# Altium schematic sheet Motor Controller(old).SchDoc
size A4
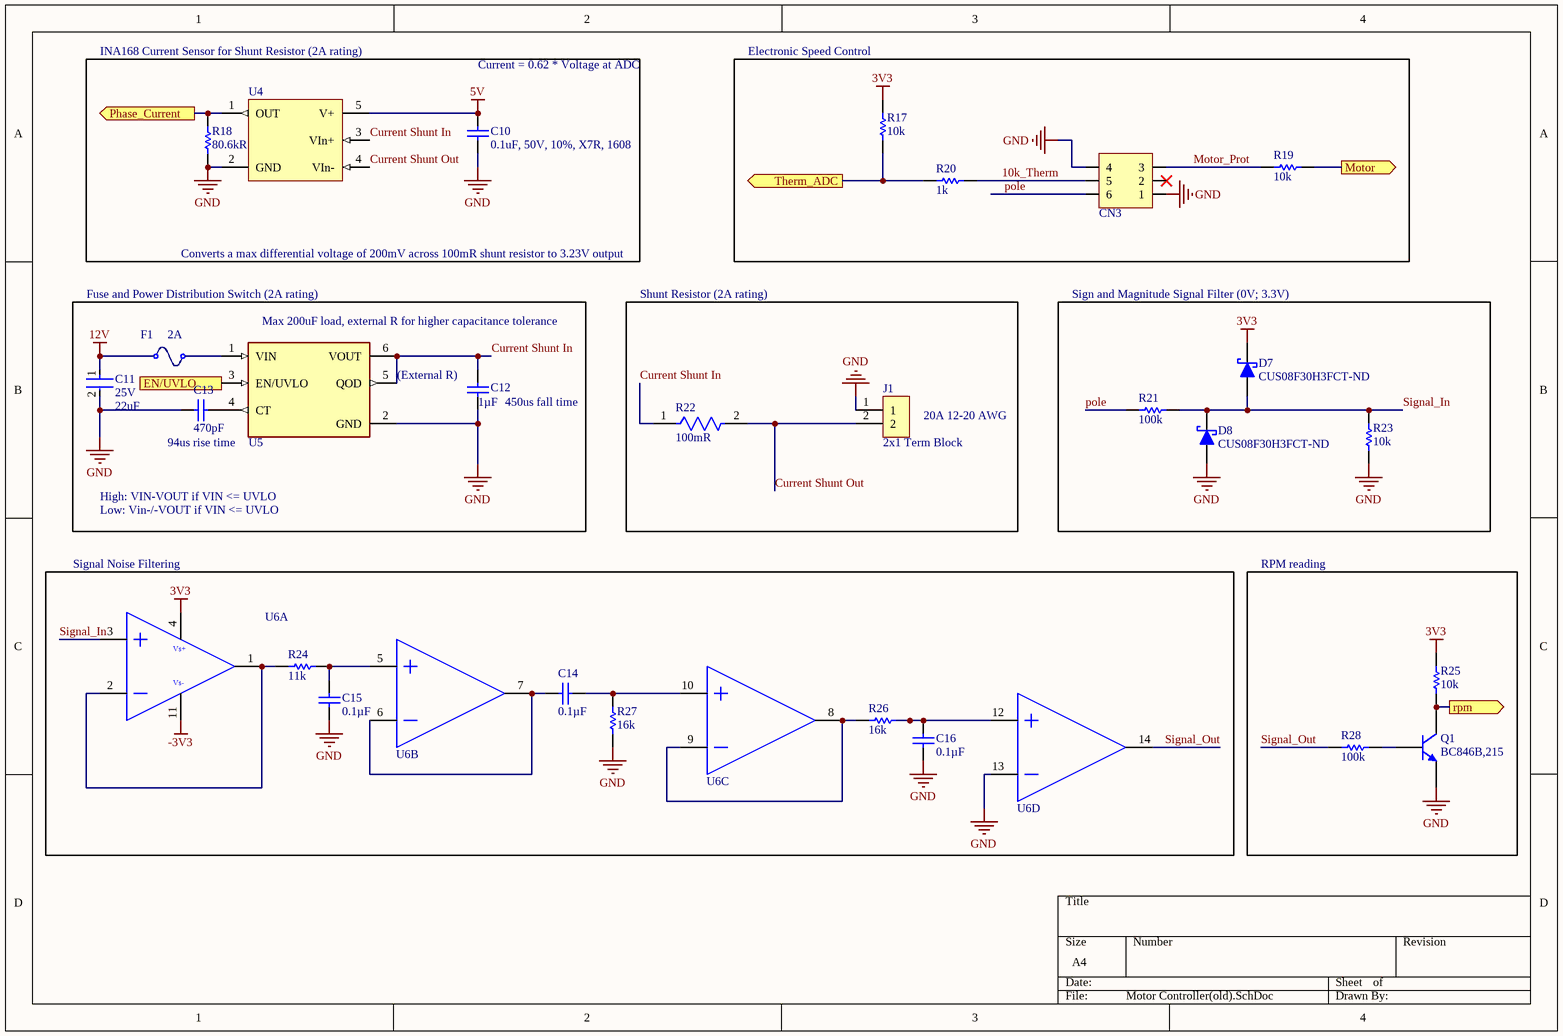
[diagram p0: Motor Controller(old).SchDoc]

## Parts
C10  0.1uF, 50V, 10%, X7R, 1608  [CAPC1608N(0603")]
C11  Voltage: 25V  Capacitance: 22uF  [FP-GRM32-IPC_A]  (hidden comment: GRM32ER71E226ME15K)
C12  value 1µF  [CAPC1608N(0603")]  (hidden comment: 1uF 50V 0603 SMD, Ceramic)
C13  value 470pF  [CAPC1608N(0603")]  (hidden comment: 470pF 50V 0603 SMD, Ceramic)
C14  Capacitance: 0.1µF  [CAPC1608N(0603")]  (hidden comment: 0.1uF, 50V, 10%, X7R, 1608)
C15  Capacitance: 0.1µF  [CAPC1608N(0603")]  (hidden comment: 0.1uF, 50V, 10%, X7R, 1608)
C16  Capacitance: 0.1µF  [CAPC1608N(0603")]  (hidden comment: 0.1uF, 50V, 10%, X7R, 1608)
CN3  Header, Male, 2x3 Conn, Shrouded, THT, 2MM RT ANG TIN  [HEADER, MALE, Shrouded, 6POS, 2MM, RT ANG,THT]  (value not drawn)
D7  CUS08F30H3FCT-ND  [SC-76]
D8  CUS08F30H3FCT-ND  [SC-76]
F1  Current Rating: 2A  [RESC1206(3216)]  (hidden comment: SMD Fuse, 2A, 63VAC, Slow Blow)
J1  2x1 Term Block  [2X1 Terminal Blocks Phoenix Contact 5mm]
Q1  BC846B,215  [SOT-23]
R17  10k  [RESC1608N(0603")]
R18  Resistance: 80.6kR  [RESC0603(1608)_M]  (hidden comment: 80.6kR, 1%, 1/10W, 0603)
R19  10k  [RESC1608N(0603")]
R20  1k  [RESC1608N(0603")]
R21  100k  [RESC1608N(0603")]
R22  Resistance: 100mR  [FP-RL2512-MFG]  (hidden comment: RL2512FK-070R1L)
R23  10k  [RESC1608N(0603")]
R24  11k  [RESC1608N(0603")]
R25  10k  [RESC1608N(0603")]
R26  16k  [RESC1608N(0603")]
R27  16k  [RESC1608N(0603")]
R28  100k  [RESC1608N(0603")]
U4  INA168, Current Sensor, High-Side, Analog  [SOT23-5]  (value not drawn)
U5  TPS22810DBVT  [FP-DBV0006A-IPC_B]  (value not drawn)
U6  Quad Op Amp TSV324  [SOP-14]  (value not drawn)  (parts A,B,C,D of 4)

## Blocks framed on the sheet
Electronic Speed Control: CN3 R17 R19 R20
Sign and Magnitude Signal Filter (0V; 3.3V): D7 D8 R21 R23
Signal Noise Filtering: C14-C16 R24 R26 R27 U6
RPM reading: Q1 R25 R28

## Ports
EN/UVLO (in), Motor (out), Phase_Current (out), rpm (out), Therm_ADC (out)

## Nets
3V3: D7.K(Cathode) R17.2 R25.2 U6.4(Vcc+)
5V: C10.2(Cathode) U4.5(V+)
12V: C11.1 F1.1
-3V3: U6.11(Vcc-)
GND: C10.1(Anode) C11.2 C12.1(Anode) C13.1 C15.1(Anode) C16.1(Anode) CN3.1 CN3.4 D8.A(Anode) J1.1 Q1.2(E) R18.1 R23.1 R27.1 U4.2(GND) U5.2(GND) U6.13(Inverting_Input_3)
10k_Therm: CN3.5 R20.2
Current Shunt In: C12.2(Cathode) R22.1 U4.3(VIn+) U5.5(QOD) U5.6(VOUT)
Current Shunt Out: J1.2 R22.2 U4.4(VIn-)
EN/UVLO: U5.3(EN/UVLO) ; port EN/UVLO
Motor: R19.1 ; port Motor
Motor_Prot: CN3.3 R19.2
Phase_Current: R18.2 U4.1(OUT) ; port Phase_Current
pole: CN3.6 R21.2
rpm: Q1.3(C) R25.1 ; port rpm
Signal_In: D7.A(Anode) D8.K(Cathode) R21.1 R23.2 U6.3(Non-Inverting_Input_1)
Signal_Out: R28.1 U6.14(Output_4)
Therm_ADC: R17.1 R20.1 ; port Therm_ADC
NetC13_2: C13.2 U5.4(CT)
NetC14_1: C14.1(Anode) U6.6(Inverting_Input_2) U6.7(Output_2)
NetC14_2: C14.2(Cathode) R27.2 U6.10(Non-Inverting_Input_3)
NetC15_2: C15.2(Cathode) R24.2 U6.5(Non-Inverting_Input_2)
NetC16_2: C16.2(Cathode) R26.1 U6.12(Non-Inverting_Input_4)
NetF1_2: F1.2 U5.1(VIN)
NetQ1_1: Q1.1(B) R28.2
NetR24_1: R24.1 U6.1(Output_1) U6.2(Inverting_Input_1)
NetR26_2: R26.2 U6.8(Output_3) U6.9(Inverting_Input_3)

Not connected (* = marked no-connect by the designer): CN3 2*

## Notes on the sheet
- INA168 Current Sensor for Shunt Resistor (2A rating)
- Current = 0.62 * Voltage at ADC
- Fuse and Power Distribution Switch (2A rating)
- Converts a max differential voltage of 200mV across 100mR shunt resistor to 3.23V output
- Shunt Resistor (2A rating)
- (near U5) Max 200uF load, external R for higher capacitance tolerance
- (near C12) (External R)
- (near U5) 94us rise time
- (near C12) 450us fall time
- (near J1) 20A 12-20 AWG
- High: VIN-VOUT if VIN <= UVLO
- Low: Vin-/-VOUT if VIN <= UVLO
- (in symbol Quad Op Amp TSV324, part A) Vs+; Vs-

## Library data of the parts
C10 = CMP-006-0008-1: CAP CER 0.1UF 50V 10% X7R 1608 (0603); Manufacturer: Samsung Electro-Mechanics America, Inc; Manufacturer Part Number: CL10B104KB8SFNC; Capacitance: 0.1µF; Size / Dimension: 0.063" L x 0.031" W (1.60mm x 0.80mm); Design Item ID: 0.1uF, 50V, 10%, X7R, 1608; RoHS: RoHS Compliant; Package / Case: 0603 (1608 Metric); Packaging: Cut Tape (CT); Height - Seated (Max): -; Component Type: Standard; Source: AUVic_Schematic_Library_Capacitors.SchLib; ComponentLink1URL: http://www.samsungsem.com/servlet/FileDownload?type=spec&file=CL10B104KB8SFNC.pdf; Tolerance: ±10%; Operating Temperature: -55°C ~ 125°C; Mounting Type: Surface Mount, MLCC; Features: Soft Termination; Lead Style: -; Pin Count: 2; Temperature Coefficient: X7R; Applications: Boardflex Sensitive; Voltage - Rated: 50V; Ratings: -; ComponentLink1Description: http://www.samsungsem.com/servlet/FileDownload?type=spec&file=CL10B104KB8SFNC.pdf; Thickness (Max): 0.035" (0.90mm); Stock 1: 743572; Category: Capacitors; Lead Spacing: -; Pricing 1: 1=0.12, 10=0.033, 25=0.0232, 100=0.0152, 500=0.01064, 1000=0.00829 (CAD)
C11 = CMP-00040-2: CAP CER 22UF 25V X7R 1210; Tolerance: 20%; Weight: 0.00388oz; Case/Package: 1210; Min Operating Temperature: -55°C; Voltage Rating: 25V; Height: 2.5mm; Case Code (Metric): 3225; Max Operating Temperature: 125°C; Width: 0.098inch; Mount: Surface Mount; Termination: SMD/SMT; Package Quantity: 4000; Voltage Rating (DC): 25V; Packaging: Tape and Reel; Composition: Ceramic; Thickness: 0.106inch; Length: 0.126inch; Case Code (Imperial): 1210; Dielectric: X7R
C12 = CMP-006-0028-1: Capacitor, Ceramic, 50V, +/- 10%, 0603 SMD, X5R; Design Item ID: 1uF 50V 0603 SMD, Ceramic; Created By: Lyden Smith; PackageDescription: Chip Capacitor; Source: AUVic_Schematic_Library_Capacitors.SchLib; Date Created: 2017-10-26; Pin Count: 2; Component Type: Standard
C13 = CMP-006-0049-1: Capacitor, Ceramic, 50V, +/- 10%, 0603 SMD, X7R; Published: May 11, 2010; Publisher: TRAXX Automation Ltd.; Pin Count: 2; LatestRevisionDate: May 11, 2010; Source: AUVic_Schematic_Library_Capacitors.SchLib; Component Type: Standard; PackageDescription: Chip Capacitor; Design Item ID: 470pF 50V 0603 SMD, Ceramic
C14-C16 = 0.1uF, 50V, 10%, X7R, 1608: CAP CER 0.1UF 50V 10% X7R 1608 (0603); Manufacturer: Samsung Electro-Mechanics America, Inc; Manufacturer Part Number: CL10B104KB8SFNC; Supplier 1: Digi-Key; RoHS: RoHS Compliant; Category: Capacitors; Stock 1: 743572; Pricing 1: 1=0.12, 10=0.033, 25=0.0232, 100=0.0152, 500=0.01064, 1000=0.00829 (CAD); Packaging: Cut Tape (CT); Tolerance: ±10%; Voltage - Rated: 50V; Temperature Coefficient: X7R; Mounting Type: Surface Mount, MLCC; Operating Temperature: -55°C ~ 125°C; Applications: Boardflex Sensitive; Ratings: -; Package / Case: 0603 (1608 Metric); Size / Dimension: 0.063" L x 0.031" W (1.60mm x 0.80mm); Height - Seated (Max): -; Thickness (Max): 0.035" (0.90mm); Lead Spacing: -; Features: Soft Termination; Lead Style: -; ComponentLink1URL: http://www.samsungsem.com/servlet/FileDownload?type=spec&file=CL10B104KB8SFNC.pdf; ComponentLink1Description: http://www.samsungsem.com/servlet/FileDownload?type=spec&file=CL10B104KB8SFNC.pdf; Supplier Part Number 1: 1276-1936-1-ND
CN3 = CMP-005-0037-1: Header, Male, 2x3, Pitch: 0.1" (2.54mm), THT; Reviewed By: *; Publisher: AUVic; Design Item ID: Header, Male, 2x3 Conn, Shrouded, THT, 2MM RT ANG TIN; Created By: Andy Bates; Pin Count: 6; Date Published: 2017-09-13; Last Updated: *; Component Type: Standard; Source: AUVic_Schematic_Library_Connectors.SchLib
D7 D8 = CUS08F30H3FCT-ND: Diode, Schottky, 30V, 800mA; Created By: Andy Bates; Publisher: AUVic; Date Created: 2016-09-09; Supplier 1: Digi-Key; Supplier Part Number 1: CUS08F30H3FCT-ND
F1 = CMP-00009-1: Fuse, Smd, 2A, Slow Blow, 1206; Fuse Type: Board Mount (Cartridge Style Excluded); Approvals: CE,cURus; Voltage Rating (AC): 63V; DC Cold Resistance: 123mR; Case Code (Metric): 3216; Min Operating Temperature: -55°C; Case/Package: 1206; Max Operating Temperature: 125°C; Mount: Surface Mount; Voltage Rating (DC): 63V; Case Code (Imperial): 1206; Packaging: Tape and Reel
J1 = 2x1 Terminal Block, 20A, 12-20AWG: Made by: Andy Bates; Date Made: 2017-11-14; Supplier 1: Digi-Key; Supplier Part Number 1: 277-6405-ND
Q1 = BC846B,215: NPN 65V 100mA 250mW; Published: 8-Jun-2000; LatestRevisionDate: 09-Sep-2016; DatasheetVersion: 1997; Publisher: Andy Bates; Supplier 1: Digi-Key; Supplier Part Number 1: 568-1632-1-ND
R17 R19 R23 R25 = 10kR, 1%, 1/10W, 0603 SMD: Made By: Ashwin Sira; Owned By: AUVic; Created On: 14-05-31; Last Edited: 14-05-31; Supplier 1: Digi-Key; Supplier Part Number 1: 311-10.0KHRCT-ND; Value: 10k
R18 = CMP-00098-1: Res Thick Film 0603 80.6K Ohm 1% 0.1W(1/10W) ±100ppm/C Molded SMD Automotive Paper T/R; Working Voltage: 75V; Temperature Coefficient: 100ppm/°C; Power Rating: 100mW; Termination: SMD/SMT; Radiation Hardening: No; Features: Automotive AEC-Q200; Number of Terminations: 2; Weight: 7.1E-05oz; Min Operating Temperature: -55°C; Tolerance: 1%; Lead Free: Lead Free; REACH SVHC: Unknown; Case Code (Imperial): 0603; Case/Package: 0603; Height: 0.45mm; Case Code (Metric): 1608; Depth: 0.85mm; Max Power Dissipation: 100mW; Resistor Type: Thick Film; Width: 0.033inch; Military Standard: Not; Voltage Rating (DC): 75V; Length: 1.55mm; Max Operating Temperature: 155°C; Contact Plating: Tin; Package Quantity: 10; Packaging: Tape and Reel; Voltage Rating: 75V
R20 = 1kR, 1%, 1/10W , 0603, SMD: Created By: Andy Bates; Publisher: AUVic; Date Created: 2017-05-10; Value: 1k; Supplier 1: Digikey; Supplier Part Number 1: 311-1.00KHRCT-ND
R21 R28 = 100kR, 1%, 1/10W, 0603 SMD: Made By: Andy Bates; Owned By: AUVic; Created On: 14-06-30; Last Edited: 14-06-30; Value: 100k; Supplier 1: Digi-Key; Supplier Part Number 1: 311-100KGRCT-ND
R22 = CMP-00128-1: Res Thick Film 2512 0.1 Ohm 1% 1W 600ppm/ C Molded SMD Embossed T/R; Tolerance: 5%; Voltage Rating: 500V; Temperature Coefficient: 600ppm/°C; Features: Moisture Resistant; Height: 0.026inch; Resistor Type: Thick Film; Resistance Tolerance: 1%; Termination: SMD/SMT; Width: 0.126inch; Case Code (Metric): 6432; Number of Terminations: 2; Size Code: 2512; Series: RL; Max Power Dissipation: 1W; Contact Plating: Tin,Lead; Max Operating Temperature: 155°C; Power Rating: 1W; Min Operating Temperature: -55°C; Lead Free: Lead Free; Package Quantity: 4000; REACH SVHC: Unknown; Length: 0.25inch; Packaging: Tape and Reel; Case Code (Imperial): 2512; Case/Package: 2512
R24 = 11kR, 1%, 1/10W, 0603 SMD: Made By: Ashwin Sira; Owned By: AUVic; Created On: 14-05-31; Last Edited: 14-05-31; Value: 11k; Supplier 1: Digi-Key; Supplier Part Number 1: 311-11.0KHRCT-ND
R26 R27 = 16kR, 1%, 1/10W, 0603 SMD: Made By: Ashwin Sira; Owned By: AUVic; Created On: 14-05-31; Last Edited: 14-05-31; Supplier 1: Digi-Key; Value: 16k; Supplier Part Number 1: 311-16.0KHRCT-ND
U4 = CMP-048-0001-2: Source: AUVic_Schematic_Library_Sensors.SchLib; Component Type: Standard; Pin Count: 5; Created By: Jacob Lower; Design Item ID: INA168, Current Sensor, High-Side, Analog; Created on: 2016-03-16; Publisher: AUVic
U5 = CMP-00127-1: TEXAS INSTRUMENTS - TPS22810DBVT - POWER LOAD SWITCH, 18V, SOT-23-6; Max Output Current: 2A; Number of Outputs: 1; Output Configuration: High Side; Interface: On/Off; Fault Protection: Over Temperature; Min Operating Temperature: -40°C; Packaging: Cut Tape; Max Operating Temperature: 105°C; Case/Package: SOT-23-6; Number of Channels: 1
U6 = Quad Op Amp TSV324: TSV324; LatestRevisionNote: Re-released for DXP Platform.; Publisher: Altium Limited; Created By: Jordan; Creation Date: 10/14/2016; Supplier: Digikey; Supplier Part Number: 497-8198-2-ND